# Altium project Dashcam_V2.0B.PrjPcb (part 6 of 7)

## Sheet Converter.SchDoc: CONVERTER
size A2; DrawnBy: UKAYACIK; Engineer: UKAYACIK; DocumentNumber: 14; Revision: B; SheetNumber: 11; SheetTotal: 21
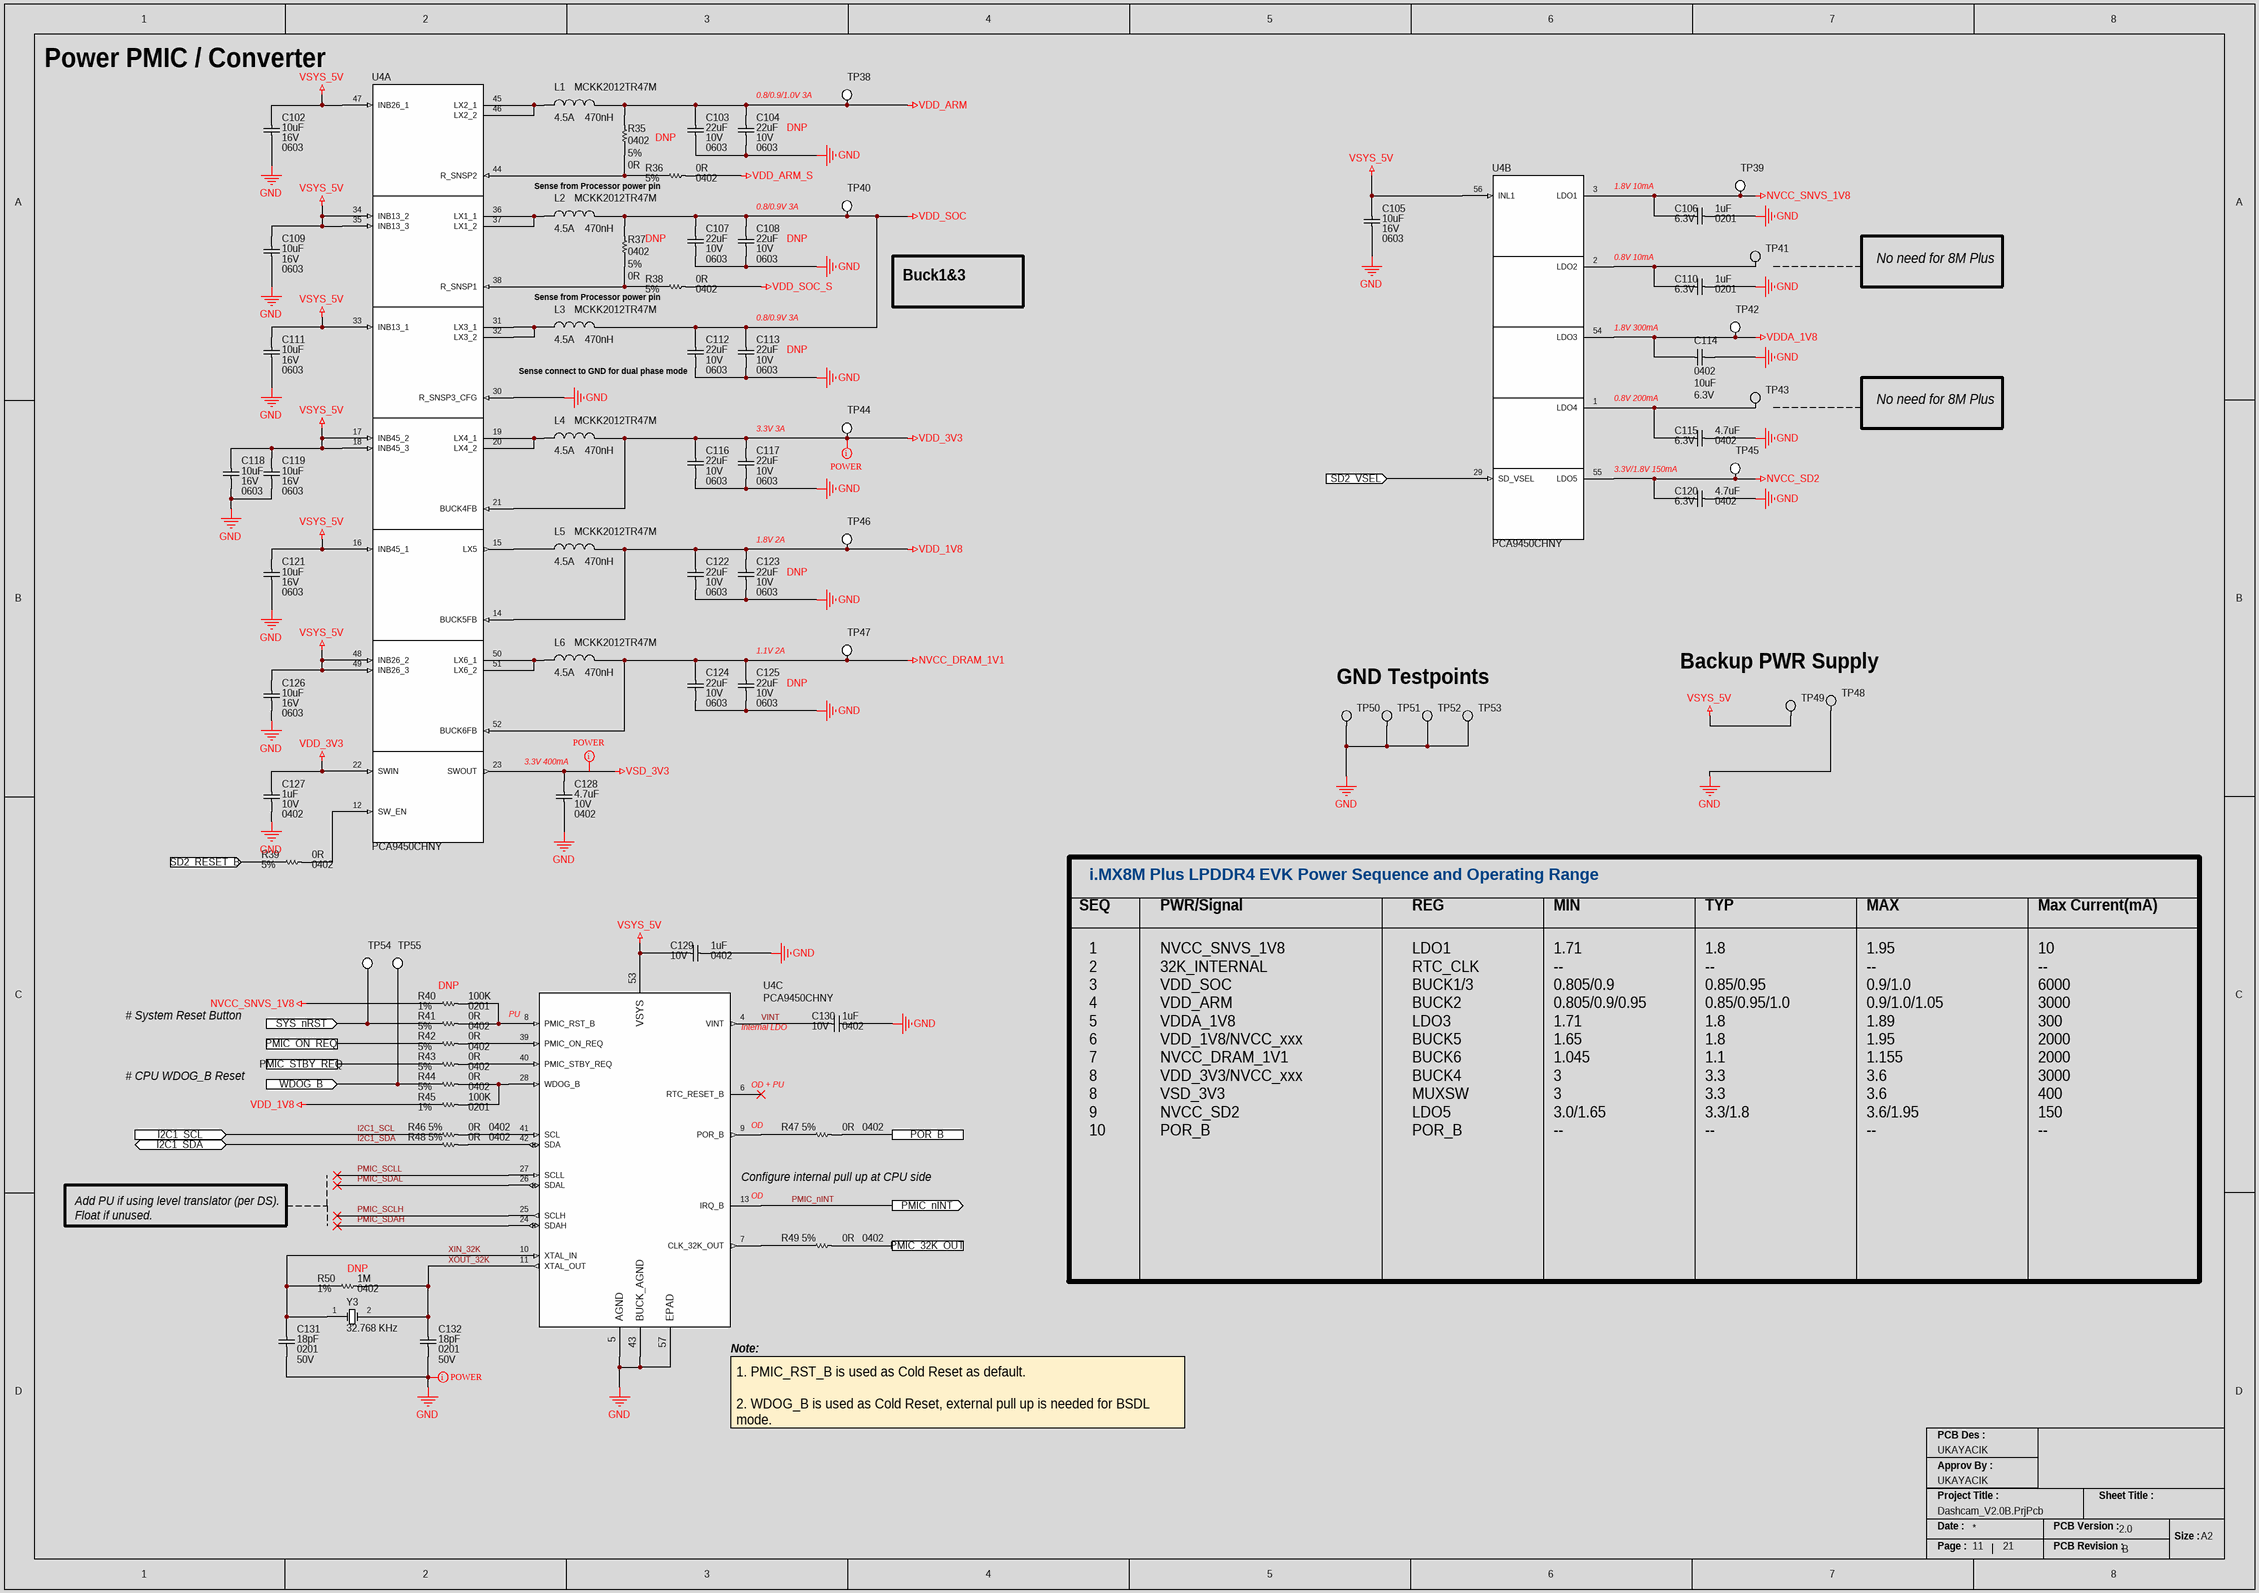
[diagram p13: Converter.SchDoc]

### Parts
C102  Voltage Rating: 16V  Capacitance: 10uF  Case/Package: 0603  [CAP_0603_CAPC1608X08N]  (hidden comment: GRM188R61C106MAALD)
C103  Capacitance: 22uF  Voltage Rating: 10V  Case Code (Imperial): 0603  [CAP_0603_CAPC1608X08N]  (hidden comment: C1608X5R1A226M080AC)
C104  Capacitance: 22uF  Voltage Rating: 10V  Case Code (Imperial): 0603  [CAP_0603_CAPC1608X08N]  (hidden comment: C1608X5R1A226M080AC)
C105  Voltage Rating: 16V  Capacitance: 10uF  Case/Package: 0603  [CAP_0603_CAPC1608X08N]  (hidden comment: GRM188R61C106MAALD)
C106  Voltage Rating (DC): 6.3V  Capacitance: 1uF  Case/Package: 0201  [CAP_0201_CAPC0603X03N]  (hidden comment: 02016D105MAT2A)
C107  Capacitance: 22uF  Voltage Rating: 10V  Case Code (Imperial): 0603  [CAP_0603_CAPC1608X08N]  (hidden comment: C1608X5R1A226M080AC)
C108  Capacitance: 22uF  Voltage Rating: 10V  Case Code (Imperial): 0603  [CAP_0603_CAPC1608X08N]  (hidden comment: C1608X5R1A226M080AC)
C109  Voltage Rating: 16V  Capacitance: 10uF  Case/Package: 0603  [CAP_0603_CAPC1608X08N]  (hidden comment: GRM188R61C106MAALD)
C110  Voltage Rating (DC): 6.3V  Capacitance: 1uF  Case/Package: 0201  [CAP_0201_CAPC0603X03N]  (hidden comment: 02016D105MAT2A)
C111  Voltage Rating: 16V  Capacitance: 10uF  Case/Package: 0603  [CAP_0603_CAPC1608X08N]  (hidden comment: GRM188R61C106MAALD)
C112  Capacitance: 22uF  Voltage Rating: 10V  Case Code (Imperial): 0603  [CAP_0603_CAPC1608X08N]  (hidden comment: C1608X5R1A226M080AC)
C113  Capacitance: 22uF  Voltage Rating: 10V  Case Code (Imperial): 0603  [CAP_0603_CAPC1608X08N]  (hidden comment: C1608X5R1A226M080AC)
C114  Case/Package: 0402  Capacitance: 10uF  Voltage Rating: 6.3V  [CAP_0402_CAPC1005X05N]  (hidden comment: CL05A106MQ5NUNC)
C115  Capacitance: 4.7uF  Voltage Rating: 6.3V  Case/Package: 0402  [CAP_0402_CAPC1005X05N]  (hidden comment: C1005X5R0J475M050BC)
C116  Capacitance: 22uF  Voltage Rating: 10V  Case Code (Imperial): 0603  [CAP_0603_CAPC1608X08N]  (hidden comment: C1608X5R1A226M080AC)
C117  Capacitance: 22uF  Voltage Rating: 10V  Case Code (Imperial): 0603  [CAP_0603_CAPC1608X08N]  (hidden comment: C1608X5R1A226M080AC)
C118  Voltage Rating: 16V  Capacitance: 10uF  Case/Package: 0603  [CAP_0603_CAPC1608X08N]  (hidden comment: GRM188R61C106MAALD)
C119  Voltage Rating: 16V  Capacitance: 10uF  Case/Package: 0603  [CAP_0603_CAPC1608X08N]  (hidden comment: GRM188R61C106MAALD)
C120  Capacitance: 4.7uF  Voltage Rating: 6.3V  Case/Package: 0402  [CAP_0402_CAPC1005X05N]  (hidden comment: C1005X5R0J475M050BC)
C121  Voltage Rating: 16V  Capacitance: 10uF  Case/Package: 0603  [CAP_0603_CAPC1608X08N]  (hidden comment: GRM188R61C106MAALD)
C122  Capacitance: 22uF  Voltage Rating: 10V  Case Code (Imperial): 0603  [CAP_0603_CAPC1608X08N]  (hidden comment: C1608X5R1A226M080AC)
C123  Capacitance: 22uF  Voltage Rating: 10V  Case Code (Imperial): 0603  [CAP_0603_CAPC1608X08N]  (hidden comment: C1608X5R1A226M080AC)
C124  Capacitance: 22uF  Voltage Rating: 10V  Case Code (Imperial): 0603  [CAP_0603_CAPC1608X08N]  (hidden comment: C1608X5R1A226M080AC)
C125  Capacitance: 22uF  Voltage Rating: 10V  Case Code (Imperial): 0603  [CAP_0603_CAPC1608X08N]  (hidden comment: C1608X5R1A226M080AC)
C126  Voltage Rating: 16V  Capacitance: 10uF  Case/Package: 0603  [CAP_0603_CAPC1608X08N]  (hidden comment: GRM188R61C106MAALD)
C127  Voltage Rating: 10V  Capacitance: 1uF  Case/Package: 0402  [CAP_0402_CAPC1005X05N]  (hidden comment: GRM155C81A105KA12D)
C128  Capacitance: 4.7uF  Voltage Rating: 10V  Case/Package: 0402  [CAP_0402_CAPC1005X05N]  (hidden comment: CL05A475KP5NRNC)
C129  Voltage Rating: 10V  Capacitance: 1uF  Case/Package: 0402  [CAP_0402_CAPC1005X05N]  (hidden comment: GRM155C81A105KA12D)
C130  Voltage Rating: 10V  Capacitance: 1uF  Case/Package: 0402  [CAP_0402_CAPC1005X05N]  (hidden comment: GRM155C81A105KA12D)
C131  Capacitance: 18pF  Voltage Rating: 50V  Case/Package: 0201  [CAP_0201_CAPC0603X03N]  (hidden comment: GRM0335C1H180JA01D)
C132  Capacitance: 18pF  Voltage Rating: 50V  Case/Package: 0201  [CAP_0201_CAPC0603X03N]  (hidden comment: GRM0335C1H180JA01D)
L1  MCKK2012TR47M  Current Rating: 4.5A  Inductance: 470nH  [IND_0805_INDC2012X10N]
L2  MCKK2012TR47M  Current Rating: 4.5A  Inductance: 470nH  [IND_0805_INDC2012X10N]
L3  MCKK2012TR47M  Current Rating: 4.5A  Inductance: 470nH  [IND_0805_INDC2012X10N]
L4  MCKK2012TR47M  Current Rating: 4.5A  Inductance: 470nH  [IND_0805_INDC2012X10N]
L5  MCKK2012TR47M  Current Rating: 4.5A  Inductance: 470nH  [IND_0805_INDC2012X10N]
L6  MCKK2012TR47M  Current Rating: 4.5A  Inductance: 470nH  [IND_0805_INDC2012X10N]
R35  Case Code (Imperial): 0402  Tolerance: 5%  Resistance: 0R  [RES_0402_RESC1005X04N]  (hidden comment: ERJ-2GE0R00X)
R36  Case Code (Imperial): 0402  Tolerance: 5%  Resistance: 0R  [RES_0402_RESC1005X04N]  (hidden comment: ERJ-2GE0R00X)
R37  Case Code (Imperial): 0402  Tolerance: 5%  Resistance: 0R  [RES_0402_RESC1005X04N]  (hidden comment: ERJ-2GE0R00X)
R38  Case Code (Imperial): 0402  Tolerance: 5%  Resistance: 0R  [RES_0402_RESC1005X04N]  (hidden comment: ERJ-2GE0R00X)
R39  Case Code (Imperial): 0402  Tolerance: 5%  Resistance: 0R  [RES_0402_RESC1005X04N]  (hidden comment: ERJ-2GE0R00X)
R40  Resistance: 100K  Tolerance: 1%  Case/Package: 0201  [RES_0201_RESC0603X02N]  (hidden comment: RC0201FR-07100KL)
R41  Case Code (Imperial): 0402  Tolerance: 5%  Resistance: 0R  [RES_0402_RESC1005X04N]  (hidden comment: ERJ-2GE0R00X)
R42  Case Code (Imperial): 0402  Tolerance: 5%  Resistance: 0R  [RES_0402_RESC1005X04N]  (hidden comment: ERJ-2GE0R00X)
R43  Case Code (Imperial): 0402  Tolerance: 5%  Resistance: 0R  [RES_0402_RESC1005X04N]  (hidden comment: ERJ-2GE0R00X)
R44  Case Code (Imperial): 0402  Tolerance: 5%  Resistance: 0R  [RES_0402_RESC1005X04N]  (hidden comment: ERJ-2GE0R00X)
R45  Resistance: 100K  Tolerance: 1%  Case/Package: 0201  [RES_0201_RESC0603X02N]  (hidden comment: RC0201FR-07100KL)
R46  Case Code (Imperial): 0402  Tolerance: 5%  Resistance: 0R  [RES_0402_RESC1005X04N]  (hidden comment: ERJ-2GE0R00X)
R47  Case Code (Imperial): 0402  Tolerance: 5%  Resistance: 0R  [RES_0402_RESC1005X04N]  (hidden comment: ERJ-2GE0R00X)
R48  Case Code (Imperial): 0402  Tolerance: 5%  Resistance: 0R  [RES_0402_RESC1005X04N]  (hidden comment: ERJ-2GE0R00X)
R49  Case Code (Imperial): 0402  Tolerance: 5%  Resistance: 0R  [RES_0402_RESC1005X04N]  (hidden comment: ERJ-2GE0R00X)
R50  Resistance: 1M  Tolerance: 1%  Case/Package: 0402  [RES_0402_RESC1005X04N]  (hidden comment: CR0402-FX-1004GLF)
TP38  NO COMPONENT  [TP_PAD_0.8MM_SMD_ROUND]  (value not drawn)  (no BOM)
TP39  NO COMPONENT  [TP_PAD_0.8MM_SMD_ROUND]  (value not drawn)  (no BOM)
TP40  NO COMPONENT  [TP_PAD_0.8MM_SMD_ROUND]  (value not drawn)  (no BOM)
TP41  NO COMPONENT  [TP_PAD_0.5MM_SMD_ROUND]  (value not drawn)  (no BOM)
TP42  NO COMPONENT  [TP_PAD_0.8MM_SMD_ROUND]  (value not drawn)  (no BOM)
TP43  NO COMPONENT  [TP_PAD_0.5MM_SMD_ROUND]  (value not drawn)  (no BOM)
TP44  NO COMPONENT  [TP_PAD_0.8MM_SMD_ROUND]  (value not drawn)  (no BOM)
TP45  NO COMPONENT  [TP_PAD_0.8MM_SMD_ROUND]  (value not drawn)  (no BOM)
TP46  NO COMPONENT  [TP_PAD_0.8MM_SMD_ROUND]  (value not drawn)  (no BOM)
TP47  NO COMPONENT  [TP_PAD_0.8MM_SMD_ROUND]  (value not drawn)  (no BOM)
TP48  NO COMPONENT  [TP_PAD_0.5MM_SMD_ROUND]  (value not drawn)  (no BOM)
TP49  NO COMPONENT  [TP_PAD_0.5MM_SMD_ROUND]  (value not drawn)  (no BOM)
TP50  NO COMPONENT  [TP_PAD_0.5MM_SMD_ROUND]  (value not drawn)  (no BOM)
TP51  NO COMPONENT  [TP_PAD_0.5MM_SMD_ROUND]  (value not drawn)  (no BOM)
TP52  NO COMPONENT  [TP_PAD_0.5MM_SMD_ROUND]  (value not drawn)  (no BOM)
TP53  NO COMPONENT  [TP_PAD_0.5MM_SMD_ROUND]  (value not drawn)  (no BOM)
TP54  NO COMPONENT  [TP_PAD_0.8MM_SMD_ROUND]  (value not drawn)  (no BOM)
TP55  NO COMPONENT  [TP_PAD_0.8MM_SMD_ROUND]  (value not drawn)  (no BOM)
U4  PCA9450CHNY  [IC_PMIC_QFN40P800X800X100-57N-D]  (parts A,B,C of 3)
Y3  Operating Frequency: 32.768 KHz  [CRYSTAL_ABS07-32.768KHZ-T]  (hidden comment: ABS07-32.768KHZ-T)

### Ports
I2C1_SCL (in), I2C1_SDA (bidir), PMIC_32K_OUT, PMIC_nINT (out), PMIC_ON_REQ, PMIC_STBY_REQ, POR_B, SD2_RESET_B (in), SD2_VSEL (in), SYS_nRST (in), WDOG_B (in)

### Nets
GND: C102.1 C103.1 C104.1 C105.1 C106.2 C107.1 C108.1 C109.1 C110.2 C111.1 C112.1 C113.1 C114.1 C115.2 C116.1 C117.1 C118.1 C119.1 C120.2 C121.1 C122.1 C123.1 C124.1 C125.1 C126.1 C127.1 C128.1 C129.1 C130.1 C131.1 C132.1 TP48.1 TP50.1 TP51.1 TP52.1 TP53.1 U4.5(AGND) U4.30(R_SNSP3_CFG) U4.43(BUCK_AGND) U4.57(EPAD)
NVCC_DRAM_1V1: C124.2 C125.2 L6.2 TP47.1 U4.52(BUCK6FB)
NVCC_SD2: C120.1 TP45.1 U4.55(LDO5)
NVCC_SNVS_1V8: C106.1 R40.1 TP39.1 U4.3(LDO1)
VDD_1V8: C122.2 C123.2 L5.2 R45.1 TP46.1 U4.14(BUCK5FB)
VDD_3V3: C116.2 C117.2 C127.2 L4.2 TP44.1 U4.21(BUCK4FB) U4.22(SWIN)
VDD_ARM: C103.2 C104.2 L1.2 R35.2 TP38.1
VDD_ARM_S: R36.2
VDD_SOC: C107.2 C108.2 C112.2 C113.2 L2.2 L3.2 R37.2 TP40.1
VDD_SOC_S: R38.2
VDDA_1V8: C114.2 TP42.1 U4.54(LDO3)
VSD_3V3: C128.2 U4.23(SWOUT)
VSYS_5V: C102.2 C105.2 C109.2 C111.2 C118.2 C119.2 C121.2 C126.2 C129.2 TP49.1 U4.16(INB45_1) U4.17(INB45_2) U4.18(INB45_3) U4.33(INB13_1) U4.34(INB13_2) U4.35(INB13_3) U4.47(INB26_1) U4.48(INB26_2) U4.49(INB26_3) U4.53(VSYS) U4.56(INL1)
I2C1_SCL: R46.1 ; port I2C1_SCL
I2C1_SDA: R48.1 ; port I2C1_SDA
PMIC_nINT: U4.13(IRQ_B) ; port PMIC_nINT
PMIC_ON_REQ: R42.1 ; port PMIC_ON_REQ
PMIC_SCLH: U4.25(SCLH)
PMIC_SCLL: U4.27(SCLL)
PMIC_SDAH: U4.24(SDAH)
PMIC_SDAL: U4.26(SDAL)
PMIC_STBY_REQ: R43.1 ; port PMIC_STBY_REQ
POR_B: R47.2 ; port POR_B
SD2_RESET_B: R39.1 ; port SD2_RESET_B
SD2_VSEL: U4.29(SD_VSEL) ; port SD2_VSEL
SLP_CLK_IN: R49.2 ; port PMIC_32K_OUT
SYS_nRST: R41.1 TP54.1 ; port SYS_nRST
VINT: C130.2 U4.4(VINT)
WDOG_B: R44.1 TP55.1 ; port WDOG_B
XIN_32K: C131.2 R50.1 U4.10(XTAL_IN) Y3.1(OSC1)
XOUT_32K: C132.2 R50.2 U4.11(XTAL_OUT) Y3.2(OSC2)
NetC110_1: C110.1 TP41.1 U4.2(LDO2)
NetC115_1: C115.1 TP43.1 U4.1(LDO4)
NetL1_1: L1.1 U4.45(LX2_1) U4.46(LX2_2)
NetL2_1: L2.1 U4.36(LX1_1) U4.37(LX1_2)
NetL3_1: L3.1 U4.31(LX3_1) U4.32(LX3_2)
NetL4_1: L4.1 U4.19(LX4_1) U4.20(LX4_2)
NetL5_1: L5.1 U4.15(LX5)
NetL6_1: L6.1 U4.50(LX6_1) U4.51(LX6_2)
NetR35_1: R35.1 R36.1 U4.44(R_SNSP2)
NetR37_1: R37.1 R38.1 U4.38(R_SNSP1)
NetR39_2: R39.2 U4.12(SW_EN)
NetR40_2: R40.2 R41.2 U4.8(PMIC_RST_B)
NetR42_2: R42.2 U4.39(PMIC_ON_REQ)
NetR43_2: R43.2 U4.40(PMIC_STBY_REQ)
NetR44_2: R44.2 R45.2 U4.28(WDOG_B)
NetR46_2: R46.2 U4.41(SCL)
NetR47_1: R47.1 U4.9(POR_B)
NetR48_2: R48.2 U4.42(SDA)
NetR49_1: R49.1 U4.7(CLK_32K_OUT)

Not connected (* = marked no-connect by the designer): U4 6(RTC_RESET_B)*

### Layout directives
net class POWER: GND, VDD_3V3, VSD_3V3

### Notes on the sheet
- Power PMIC / Converter
- DNP
- 0.8/0.9/1.0V 3A
- (near R36) Sense from Processor power pin
- 1.8V 10mA
- (near R37) DNP
- 0.8/0.9V 3A
- Buck1&3
  Dual Phase Mode
- 0.8V 10mA
- No need for 8M Plus
- (near R38) Sense from Processor power pin
- (near C113) 0.8/0.9V 3A
- 1.8V 300mA
- (near C112) Sense connect to GND for dual phase mode
- (near C117) 3.3V 3A
- (near U4) 0.8V 200mA
- 3.3V/1.8V 150mA
- (near C123) 1.8V 2A
- (near C125) 1.1V 2A
- GND Testpoints
- Backup PWR Supply
- (near C128) 3.3V 400mA
- i.MX8M Plus LPDDR4 EVK Power Sequence and Operating Range
- SEQ
- PWR/Signal
- REG
- MIN
- TYP
- MAX
- Max Current(mA)
- (near R40) DNP
- # System Reset Button
- (near U4) PU
- (near U4) Internal LDO
- # CPU WDOG_B Reset
- (near U4) OD + PU
- (near U4) OD
- (near U4) Configure internal pull up at CPU side
- 1
  2
  3
  4
  5
  6
  7
  8
  8
  9
  10
- NVCC_SNVS_1V8
  32K_INTERNAL
  VDD_SOC
  VDD_ARM
  VDDA_1V8
  VDD_1V8/NVCC_xxx
  NVCC_DRAM_1V1
  VDD_3V3/NVCC_xxx
  VSD_3V3
  NVCC_SD2
  POR_B
- LDO1
  RTC_CLK
  BUCK1/3
  BUCK2
  LDO3
  BUCK5
  BUCK6
  BUCK4
  MUXSW
  LDO5
  POR_B
- 1.71
  --
  0.805/0.9
  0.805/0.9/0.95
  1.71
  1.65
  1.045
  3
  3
  3.0/1.65
  --
- 1.8
  --
  0.85/0.95
  0.85/0.95/1.0
  1.8
  1.8
  1.1
  3.3
  3.3
  3.3/1.8
  --
- 1.95
  --
  0.9/1.0
  0.9/1.0/1.05
  1.89
  1.95
  1.155
  3.6
  3.6
  3.6/1.95
  --
- 10
  --
  6000
  3000
  300
  2000
  2000
  3000
  400
  150
  --
- Add PU if using level translator (per DS).
  Float if unused.
- (near R50) DNP
- (near U4) Note:
- (near U4) 1. PMIC_RST_B is used as Cold Reset as default.
  2. WDOG_B is used as Cold Reset, external pull up is needed for BSDL mode.
- PCB Des :
- Approv By :
- Project Title :
- Sheet Title :
- Date :
- Page :
- PCB Version :
- PCB Revision :
- Size :
- A2

### Library data of the parts
C102 C105 C109 C111 C118 C119 C121 C126 = CAP_10UF_16V_X5R_0603: 0603 10 uF 16 V ±20% Tolerance X5R Multilayer Ceramic Chip Capacitor; Manufacturer: Murata; Manufacturer Part Number: GRM188R61C106MAALD; RoHS: Yes; Category: Ceramic Capacitors; Stock 1: 566627; Pricing 1: 1=0.24000, 10=0.16500, 50=0.11000, 100=0.09340, 500=0.06596, 1000=0.05771 (USD); Mount: Surface Mount; Case Code (Metric): 1608; Material: Ceramic; Case Code (Imperial): 0603; Min Operating Temperature: -55°C; Max Operating Temperature: 85°C; Tolerance: 20%; Packaging: Cut Tape; Voltage Rating (DC): 16V; Length: 0.063inch; Width: 0.031inch; Height: 0.8mm; Thickness: 0.037inch; Lead Free: Lead Free; RoHS Compliant: Yes; ComponentLink1URL: http://search.murata.co.jp/Ceramy/image/img/A01X/G101/ENG/GRM188R61C106MAAL-01.pdf?src-supplier=Digi-Key; ComponentLink1Description: http://search.murata.co.jp/Ceramy/image/img/A01X/G101/ENG/GRM188R61C106MAAL-01.pdf?src-supplier=Digi-Key; ComponentLink2URL: https://search.murata.co.jp/Ceramy/image/img/A01X/G101/ENG/GRM188R61C106MAAL-01.pdf?src-supplier=Digi-Key; ComponentLink2Description: https://search.murata.co.jp/Ceramy/image/img/A01X/G101/ENG/GRM188R61C106MAAL-01.pdf?src-supplier=Digi-Key; ComponentLink3URL: http://search.murata.co.jp/Ceramy/image/img/A01X/partnumbering_e_01.pdf?src-supplier=Digi-Key; ComponentLink3Description: http://search.murata.co.jp/Ceramy/image/img/A01X/partnumbering_e_01.pdf?src-supplier=Digi-Key; Supplier 1: Digi-Key; Supplier 2: Verical; Supplier 3: Mouser; Supplier Part Number 1: 490-10729-1-ND; Supplier Part Number 2: GRM188R61C106MAALD; Supplier Part Number 3: 81-GRM188R61C106MALD
C103 C104 C107 C108 C112 C113 C116 C117 C122-C125 = CAP_22UF_10V_X5R_0603: Multilayer Ceramic Capacitor, 22 uF, 10 V, ± 20%, X5R, 0603 [1608 Metric]; Manufacturer: TDK; Supplier 1: Digi-Key; Manufacturer Part Number: C1608X5R1A226M080AC; RoHS: Yes; Category: Ceramic Capacitors; Stock 1: 1971709; Pricing 1: 1=0.32, 10=0.208, 50=0.1534, 100=0.1248, 500=0.09856, 1000=0.08323 (USD); Mount: Surface Mount; Case/Package: 0603; Case Code (Metric): 1608; Dielectric Material: Ceramic; Weight: 7.1E-05oz; Min Operating Temperature: -55°C; Max Operating Temperature: 85°C; Tolerance: 20%; Packaging: Tape and Reel; Voltage Rating (DC): 10V; Termination: SMD/SMT; Series: C; Package Quantity: 4000; Dielectric: X5R; Length: 1.6mm; Width: 0.8mm; Height: 0.8mm; Reach SVHC Compliant: No; Lead Free: Lead Free; RoHS Compliant: Yes; ComponentLink1URL: https://datasheet.ciiva.com/6274/tdkmlcccaprange-6274860.pdf?src-supplier=Digi-Key; ComponentLink1Description: https://datasheet.ciiva.com/6274/tdkmlcccaprange-6274860.pdf?src-supplier=Digi-Key; ComponentLink2URL: https://datasheet.ciiva.com/6274/tdkmlcccaprange-6274859.pdf?src-supplier=Digi-Key; ComponentLink2Description: https://datasheet.ciiva.com/6274/tdkmlcccaprange-6274859.pdf?src-supplier=Digi-Key; ComponentLink3URL: https://datasheet.ciiva.com/6274/tdkmlcccaprange-6274861.pdf?src-supplier=Digi-Key; ComponentLink3Description: https://datasheet.ciiva.com/6274/tdkmlcccaprange-6274861.pdf?src-supplier=Digi-Key; ComponentLink4URL: https://datasheet.ciiva.com/24216/mlcc-commercial-general-en-24216575.pdf?src-supplier=Mouser; ComponentLink4Description: https://datasheet.ciiva.com/24216/mlcc-commercial-general-en-24216575.pdf?src-supplier=Mouser; Supplier Part Number 1: 445-9077-1-ND
C106 C110 = CAP_1UF_6.3V_X5R_0201: 0201 1 uF 6.3 V ±20 % Tolerance X5R Surface Mount Multilayer Ceramic Capacitor; Manufacturer: Kyocera AVX; Tolerance: 20%; Supplier 1: Mouser; Manufacturer Part Number: 02016D105MAT2A; RoHS: Yes; Category: Ceramic Capacitors; Stock 1: 1026413; Pricing 1: 1=0.1, 10=0.028, 50=0.028, 100=0.014, 1000=0.008, 10000=0.006 (USD); Mount: Surface Mount; Number of Pins: 2; Case Code (Metric): 0603; Case Code (Imperial): 0201; Min Operating Temperature: -55°C; Max Operating Temperature: 85°C; Packaging: Cut Tape; Series: -; Voltage Rating: 6.3V; Package Quantity: 1; Length: 0.024inch; Width: 0.012inch; Thickness: 0.013inch; Depth: 0.3mm; Lead Free: Lead Free; RoHS Compliant: Yes; Reach SVHC Compliant: No; ComponentLink1URL: https://datasheet.ciiva.com/6265/cx5r-6265595.pdf?src-supplier=Digi-Key; ComponentLink1Description: https://datasheet.ciiva.com/6265/cx5r-6265595.pdf?src-supplier=Digi-Key; ComponentLink2URL: https://datasheet.ciiva.com/1123/1666675-1123122.pdf?src-supplier=Element14; ComponentLink2Description: https://datasheet.ciiva.com/1123/1666675-1123122.pdf?src-supplier=Element14; ComponentLink3URL: https://datasheet.ciiva.com/14891/cx5r-14891029.pdf?src-supplier=Digi-Key; ComponentLink3Description: https://datasheet.ciiva.com/14891/cx5r-14891029.pdf?src-supplier=Digi-Key; ComponentLink4URL: https://datasheet.ciiva.com/7614/cx5r-7614682.pdf?src-supplier=Digi-Key; ComponentLink4Description: https://datasheet.ciiva.com/7614/cx5r-7614682.pdf?src-supplier=Digi-Key; ComponentLink5URL: https://datasheet.ciiva.com/14891/cx5r-14891030.pdf?src-supplier=Digi-Key; ComponentLink5Description: https://datasheet.ciiva.com/14891/cx5r-14891030.pdf?src-supplier=Digi-Key; Supplier Part Number 1: 581-02016D105MAT2A; Dielectric: X5R
C114 = CAP_10UF_6.3V_X5R_0402: Cap Ceramic 10uF 6.3V X5R 20% SMD 0402 85C T/R; Manufacturer: Samsung; Supplier 1: Digikey; Manufacturer Part Number: CL05A106MQ5NUNC; RoHS: Yes; Category: Ceramic Capacitors; Stock 1: 6097180; Pricing 1: 1=0.24, 10=0.153, 50=0.0968, 100=0.0774, 500=0.05588, 1000=0.04943, 2500=0.04728, 5000=0.04299 (USD); Mount: Surface Mount; Case Code (Metric): 1005; Case Code (Imperial): 0402; Min Operating Temperature: -55°C; Max Operating Temperature: 85°C; Packaging: Tape and Reel; Tolerance: 20%; Dielectric: X5R; Series: CL; Package Quantity: 1; Construction: Flat; Length: 1mm; Width: 0.02inch; Height: 0.5mm; Depth: 0.5mm; Thickness: 0.028inch; Radiation Hardening: No; RoHS Compliant: Yes; ComponentLink1URL: https://datasheet.ciiva.com/16437/cl05a106mq5nunc-16437356.pdf?src-supplier=Future+Electronics; ComponentLink1Description: https://datasheet.ciiva.com/16437/cl05a106mq5nunc-16437356.pdf?src-supplier=Future+Electronics; ComponentLink2URL: https://datasheet.ciiva.com/26877/getdatasheetpartid-355289-26877841.pdf?src-supplier=Verical; ComponentLink2Description: https://datasheet.ciiva.com/26877/getdatasheetpartid-355289-26877841.pdf?src-supplier=Verical; Supplier Part Number 1: 1276-1451-1-ND
C115 C120 = CAP_4.7UF_6.3V_X5R_0402: Multilayer Ceramic Capacitor, 4.7 uF, 6.3 V, ± 20%, X5R, 0402 [1005 Metric]; Manufacturer: TDK; Material: 4241ConductorMaterial; Dissipation Factor: 10%; Supplier 1: Digi-Key; Manufacturer Part Number: C1005X5R0J475M050BC; RoHS: Yes; Category: Ceramic Capacitors; Stock 1: 799722; Pricing 1: 1=0.35, 10=0.233, 50=0.1716, 100=0.1396, 500=0.11024, 1000=0.0931, 2500=0.0882, 5000=0.0833 (USD); Mount: Surface Mount; Dielectric Material: Ceramic; Case Code (Metric): 1005; Case Code (Imperial): 0402; Weight: 2.3E-05oz; Min Operating Temperature: -55°C; Max Operating Temperature: 85°C; Packaging: Tape and Reel; Tolerance: 20%; Voltage Rating (DC): 6.3V; Dielectric: X5R; Package Quantity: 1; Termination: SMD/SMT; Voltage: 6.3V; Series: C; Construction: Flat; Length: 1mm; Width: 0.02inch; Height: 0.5mm; Depth: 0.5mm; Thickness: 0.026inch; Lead Free: Lead Free; Reach SVHC Compliant: No; RoHS Compliant: Yes; ComponentLink1URL: https://datasheet.ciiva.com/24216/c1005x5r0j475m050bc-264348-24216583.pdf?src-supplier=Mouser; ComponentLink1Description: https://datasheet.ciiva.com/24216/c1005x5r0j475m050bc-264348-24216583.pdf?src-supplier=Mouser; ComponentLink2URL: https://datasheet.ciiva.com/5962/639999-5962567.pdf?src-supplier=Farnell; ComponentLink2Description: https://datasheet.ciiva.com/5962/639999-5962567.pdf?src-supplier=Farnell; ComponentLink3URL: https://datasheet.ciiva.com/22648/1796654-22648701.pdf?src-supplier=Element14; ComponentLink3Description: https://datasheet.ciiva.com/22648/1796654-22648701.pdf?src-supplier=Element14; ComponentLink4URL: https://datasheet.ciiva.com/22749/1744655-22749711.pdf?src-supplier=Element14; ComponentLink4Description: https://datasheet.ciiva.com/22749/1744655-22749711.pdf?src-supplier=Element14; ComponentLink5URL: https://datasheet.ciiva.com/7770/639999-7770124.pdf?src-supplier=Element14; ComponentLink5Description: https://datasheet.ciiva.com/7770/639999-7770124.pdf?src-supplier=Element14; ComponentLink6URL: https://datasheet.ciiva.com/6289/tdkmlcccaprange-6289886.pdf?src-supplier=Digi-Key; ComponentLink6Description: https://datasheet.ciiva.com/6289/tdkmlcccaprange-6289886.pdf?src-supplier=Digi-Key; ComponentLink7URL: https://datasheet.ciiva.com/6289/tdkmlcccaprange-6289895.pdf?src-supplier=Digi-Key; ComponentLink7Description: https://datasheet.ciiva.com/6289/tdkmlcccaprange-6289895.pdf?src-supplier=Digi-Key; ComponentLink8URL: https://datasheet.ciiva.com/16425/e412-c-16425670.pdf?src-supplier=Future+Electronics; ComponentLink8Description: https://datasheet.ciiva.com/16425/e412-c-16425670.pdf?src-supplier=Future+Electronics; Supplier Part Number 1: 445-7395-1-ND
C127 C129 C130 = CAP_1UF_10V_X6S_0402: 0402 10 V 1 uF ±10% Tolerance X6S Multilayer Ceramic Capacitor; Manufacturer: Murata; Supplier 1: Digikey; Manufacturer Part Number: GRM155C81A105KA12D; RoHS: Yes; Category: Ceramic Capacitors; Stock 1: 2486564; Pricing 1: 1=0.1, 10=0.045, 50=0.026, 100=0.0202, 500=0.01518, 1000=0.01192, 2500=0.01084, 5000=0.00997 (USD); Mount: Surface Mount; Case Code (Metric): 1005; Material: Ceramic; Case Code (Imperial): 0402; Weight: 0.000212oz; Min Operating Temperature: -55°C; Max Operating Temperature: 105°C; Dielectric: X6S; Packaging: Tape and Reel; Termination: SMD/SMT; Voltage Rating (DC): 10V; Package Quantity: 10000; Series: GRM; Length: 1mm; Width: 0.5mm; Height: 0.5mm; Thickness: 0.022inch; Lead Free: Lead Free; RoHS Compliant: Yes; ComponentLink1URL: http://www.mouser.com/ds/2/281/c02e-2905.pdf?src-supplier=Mouser; ComponentLink1Description: http://www.mouser.com/ds/2/281/c02e-2905.pdf?src-supplier=Mouser; ComponentLink2URL: https://datasheet.octopart.com/GRM155C81A105KA12D-Murata-datasheet-22122223.pdf?src-supplier=Future+Electronics; ComponentLink2Description: https://datasheet.octopart.com/GRM155C81A105KA12D-Murata-datasheet-22122223.pdf?src-supplier=Future+Electronics; ComponentLink3URL: https://datasheet.octopart.com/GRM155C81A105KA12D-Murata-datasheet-149522926.pdf?src-supplier=Newark; ComponentLink3Description: https://datasheet.octopart.com/GRM155C81A105KA12D-Murata-datasheet-149522926.pdf?src-supplier=Newark; ComponentLink4URL: http://search.murata.co.jp/Ceramy/image/img/A01X/G101/ENG/GRM155C81A105KA12-01.pdf?src-supplier=Digikey; ComponentLink4Description: http://search.murata.co.jp/Ceramy/image/img/A01X/G101/ENG/GRM155C81A105KA12-01.pdf?src-supplier=Digikey; ComponentLink5URL: http://search.murata.co.jp/Ceramy/image/img/A01X/partnumbering_e_01.pdf?src-supplier=Digikey; ComponentLink5Description: http://search.murata.co.jp/Ceramy/image/img/A01X/partnumbering_e_01.pdf?src-supplier=Digikey; ComponentLink6URL: https://datasheet.octopart.com/GRM155C81A105KA12D-Murata-datasheet-165579666.pdf?src-supplier=TME; ComponentLink6Description: https://datasheet.octopart.com/GRM155C81A105KA12D-Murata-datasheet-165579666.pdf?src-supplier=TME; Supplier Part Number 1: 490-12699-6-ND; Tolerance: 10%
C128 = CAP_4.7UF_10V_X5R_0402: Multilayer Ceramic Capacitor, 4.7 uF, 10 V, ± 10%, X5R, 0402 [1005 Metric]; Manufacturer: Samsung; Supplier 1: Digikey; Manufacturer Part Number: CL05A475KP5NRNC; RoHS: Yes; Category: Ceramic Capacitors; Stock 1: 748042; Pricing 1: 1=0.28, 10=0.184, 50=0.129, 100=0.1042, 500=0.0774, 1000=0.06772, 2500=0.0645, 5000=0.05966 (USD); Mount: Surface Mount; Case Code (Metric): 1005; Case Code (Imperial): 0402; Material: Ceramic; Min Operating Temperature: -55°C; Max Operating Temperature: 85°C; Tolerance: 10%; Packaging: Tape and Reel; Package Quantity: 1; Dielectric: X5R; Series: CL; Construction: Flat; Length: 1mm; Width: 0.02inch; Height: 0.5mm; Thickness: 0.022inch; Depth: 0.5mm; Radiation Hardening: No; RoHS Compliant: Yes; Lead Free: Lead Free; ComponentLink1URL: https://datasheet.ciiva.com/25724/cl05a475kp5nrnc-25724404.pdf?src-supplier=Digikey; ComponentLink1Description: https://datasheet.ciiva.com/25724/cl05a475kp5nrnc-25724404.pdf?src-supplier=Digikey; ComponentLink2URL: https://datasheet.ciiva.com/29198/458873-da-01-en-vs-kondensator-0402-29198304.pdf?src-supplier=Conrad; ComponentLink2Description: https://datasheet.ciiva.com/29198/458873-da-01-en-vs-kondensator-0402-29198304.pdf?src-supplier=Conrad; Supplier Part Number 1: 1276-1480-1-ND
C131 C132 = CAP_18PF_50V_NP0_0201: Multilayer Ceramic Capacitor, 18 pF, 50 V, ± 5%, C0G (NP0), 0201 [0603 Metric]; Manufacturer: Murata; Temperature Coefficient: 30ppm/°C; Supplier 1: Digikey; Manufacturer Part Number: GRM0335C1H180JA01D; RoHS: Yes; Category: Ceramic Capacitors; Stock 1: 464126; Pricing 1: 1=0.1, 10=0.011, 50=0.0062, 100=0.0048, 500=0.0036, 1000=0.00283, 2500=0.00258, 5000=0.00237 (USD); Mount: Surface Mount; Case Code (Metric): 0603; Case Code (Imperial): 0201; Material: Ceramic; Min Operating Temperature: -55°C; Max Operating Temperature: 125°C; Package Quantity: 15000; Packaging: Tape and Reel; Voltage Rating (DC): 50V; Termination: SMD/SMT; Series: GRM; Dielectric: C0G; Tolerance: 5%; Voltage: 50V; Length: 0.6mm; Width: 0.3mm; Height: 0.3mm; Depth: 0.3mm; Radiation Hardening: No; RoHS Compliant: Yes; Lead Free: Lead Free; Supplier Part Number 1: 490-6117-1-ND
L1-L6 = IND_0.47uH_4.5A_MCKK2012TR47M: Inductor Power Chip Multi-Layer 0.47uH 20% 1MHz Metal 3.1A 0.039Ohm DCR 0805 T/R; Manufacturer: Taiyo Yuden; Shielding: Shielded; DC Resistance (DCR): 39mR; Supplier 1: Digi-Key; Manufacturer Part Number: MCKK2012TR47M; RoHS: Yes; Category: Fixed Inductors; Stock 1: 59761; Pricing 1: 1=0.34, 10=0.279, 25=0.2572, 50=0.2358, 100=0.2079, 250=0.20152, 500=0.18008, 1000=0.14577 (USD); Mount: Surface Mount; Case/Package: 0805; Core Material: Metal; Case Code (Metric): 2012; Min Operating Temperature: -40°C; Max Operating Temperature: 125°C; Packaging: Cut Tape; Tolerance: 20%; Test Frequency: 1MHz; Series: MCOIL™, MC; RoHS Compliant: Yes; ComponentLink1URL: https://ds.yuden.co.jp/TYCOMPAS/ut/detail?pn=MCKK2012TR47M &amp;u=M&src-supplier=Digi-Key; ComponentLink1Description: https://ds.yuden.co.jp/TYCOMPAS/ut/detail?pn=MCKK2012TR47M &amp;u=M&src-supplier=Digi-Key; ComponentLink2URL: http://ds.yuden.co.jp/TYCOMPAS/ut/detail.do?productNo=MCKK2012TR47M&fileName=MCKK2012TR47M_SS&mode=specSheetDownload&src-supplier=Digi-Key; ComponentLink2Description: http://ds.yuden.co.jp/TYCOMPAS/ut/detail.do?productNo=MCKK2012TR47M&fileName=MCKK2012TR47M_SS&mode=specSheetDownload&src-supplier=Digi-Key; ComponentLink3URL: http://ds.yuden.co.jp/TYCOMPAS/ut/detail.do?productNo=MCKK2012TR47M&amp;fileName=MCKK2012TR47M_SS&amp;mode=specSheetDownload&src-supplier=Digi-Key; ComponentLink3Description: http://ds.yuden.co.jp/TYCOMPAS/ut/detail.do?productNo=MCKK2012TR47M&amp;fileName=MCKK2012TR47M_SS&amp;mode=specSheetDownload&src-supplier=Digi-Key; Supplier Part Number 1: 587-5632-1-ND; Case Code (Imperial): 0805
R35-R39 R41-R44 R46-R49 = RES_0R_5%_100mW_0402: SMD Chip Resistor, Jumper, 0 ohm, 100 mW, 0402 [1005 Metric], Thick Film, General Purpose; Manufacturer: Panasonic; Power Rating: 100mW; Voltage Rating: 50V; Temperature Coefficient: 600ppm/°C; Supplier 1: Mouser; Manufacturer Part Number: ERJ-2GE0R00X; RoHS: Yes; Category: Chip SMD Resistors; Stock 1: 10989354; Pricing 1: 1=0.1, 10=0.013, 50=0.013, 100=0.006, 1000=0.004, 2500=0.003, 10000=0.003 (USD); Mount: Surface Mount; Case/Package: 0402; Contact Plating: Tin; Case Code (Metric): 1005; Size Code: 0402; Min Operating Temperature: -55°C; Max Operating Temperature: 155°C; Resistor Type: Thick Film; Packaging: Cut Tape; Package Quantity: 10000; Number of Terminations: 2; Termination: SMD/SMT; Max Power Dissipation: 100mW; Voltage Rating (DC): 50V; Features: Automotive AEC-Q200; Series: ERJ; Construction: Rectangular; Technology: THICK FILM; Length: 1mm; Width: 0.5mm; Height: 0.35mm; Depth: 0.5mm; Ratings: AEC-Q200; Radiation Hardening: No; Reach SVHC Compliant: No; Military Standard: Not; Lead Free: Lead Free; RoHS Compliant: Yes; ComponentLink1URL: https://datasheet.ciiva.com/11821/0900766b80f806dd-11821176.pdf?src-supplier=Rs; ComponentLink1Description: https://datasheet.ciiva.com/11821/0900766b80f806dd-11821176.pdf?src-supplier=Rs; ComponentLink2URL: https://datasheet.ciiva.com/43460/1678796-43460347.pdf?src-supplier=Farnell; ComponentLink2Description: https://datasheet.ciiva.com/43460/1678796-43460347.pdf?src-supplier=Farnell; ComponentLink3URL: https://datasheet.ciiva.com/46389/1678796-46389518.pdf?src-supplier=Element14; ComponentLink3Description: https://datasheet.ciiva.com/46389/1678796-46389518.pdf?src-supplier=Element14; ComponentLink4URL: https://datasheet.ciiva.com/5959/1678796-5959692.pdf?src-supplier=Farnell; ComponentLink4Description: https://datasheet.ciiva.com/5959/1678796-5959692.pdf?src-supplier=Farnell; ComponentLink5URL: https://datasheet.ciiva.com/28695/1678796-28695758.pdf?src-supplier=Element14; ComponentLink5Description: https://datasheet.ciiva.com/28695/1678796-28695758.pdf?src-supplier=Element14; ComponentLink6URL: https://datasheet.ciiva.com/16783/70260739-16783734.pdf?src-supplier=Allied+Electronics; ComponentLink6Description: https://datasheet.ciiva.com/16783/70260739-16783734.pdf?src-supplier=Allied+Electronics; ComponentLink7URL: https://datasheet.ciiva.com/16778/70260739-16778335.pdf?src-supplier=Allied+Electronics; ComponentLink7Description: https://datasheet.ciiva.com/16778/70260739-16778335.pdf?src-supplier=Allied+Electronics; ComponentLink8URL: https://datasheet.ciiva.com/48531/aoa0000ce1-48531077.pdf?src-supplier=Avnet; ComponentLink8Description: https://datasheet.ciiva.com/48531/aoa0000ce1-48531077.pdf?src-supplier=Avnet; ComponentLink9URL: https://datasheet.ciiva.com/30097/4aoa0000ce1-30097116.pdf?src-supplier=Onlinecomponents.com; ComponentLink9Description: https://datasheet.ciiva.com/30097/4aoa0000ce1-30097116.pdf?src-supplier=Onlinecomponents.com; Supplier Part Number 1: 667-ERJ-2GE0R00X
R40 R45 = RES_100K_1%_50mW_0201: SMD Chip Resistor, 100 kOhm, ± 1%, 50 mW, 0201 [0603 Metric], Thick Film, General Purpose; Manufacturer: Yageo; Temperature Coefficient: 200ppm/°C; Power Rating: 50mW; Voltage Rating: 25V; Supplier 1: Digikey; Manufacturer Part Number: RC0201FR-07100KL; RoHS: Yes; Category: Chip SMD Resistors; Stock 1: 2564699; Pricing 1: 1=0.1, 10=0.027, 50=0.0172, 100=0.0143, 500=0.00988, 1000=0.00854, 5000=0.00629 (USD); Number of Pins: 2NUMBER; Contact Plating: Tin,Matte; Case Code (Imperial): 0201; Case Code (Metric): 0603; Size Code: 0201; Min Operating Temperature: -55°C; Max Operating Temperature: 125°C; Resistor Type: Thick Film; Packaging: Tape and Reel; Package Quantity: 10000; Termination: SMD/SMT; Number of Terminations: 2; Max Power Dissipation: 50mW; Features: Moisture Resistant; Series: RC; Resistance Tolerance: 1%; Construction: Rectangular; Voltage Rating (DC): 25V; Length: 0.024inch; Width: 0.012inch; Height: 0.01inch; Depth: 0.3mm; Reach SVHC Compliant: No; Military Standard: Not; RoHS Compliant: Yes; Lead Free: 5697LeadFree; ComponentLink1URL: https://datasheet.ciiva.com/2493/pyu-r-int-thick-7-2493769.pdf?src-supplier=Digikey; ComponentLink1Description: https://datasheet.ciiva.com/2493/pyu-r-int-thick-7-2493769.pdf?src-supplier=Digikey; ComponentLink2URL: https://datasheet.ciiva.com/2493/pyu-r-int-thick-7-2493770.pdf?src-supplier=Digikey; ComponentLink2Description: https://datasheet.ciiva.com/2493/pyu-r-int-thick-7-2493770.pdf?src-supplier=Digikey; ComponentLink3URL: https://datasheet.ciiva.com/2493/pyu-r-int-thick-7-2493771.pdf?src-supplier=Digikey; ComponentLink3Description: https://datasheet.ciiva.com/2493/pyu-r-int-thick-7-2493771.pdf?src-supplier=Digikey; ComponentLink4URL: https://datasheet.ciiva.com/26829/getdatasheetpartid-420441-26829850.pdf?src-supplier=Verical; ComponentLink4Description: https://datasheet.ciiva.com/26829/getdatasheetpartid-420441-26829850.pdf?src-supplier=Verical; ComponentLink5URL: https://datasheet.ciiva.com/22698/1563626-22698495.pdf?src-supplier=Element14; ComponentLink5Description: https://datasheet.ciiva.com/22698/1563626-22698495.pdf?src-supplier=Element14; ComponentLink6URL: https://datasheet.ciiva.com/7660/1421516-7660806.pdf?src-supplier=Element14; ComponentLink6Description: https://datasheet.ciiva.com/7660/1421516-7660806.pdf?src-supplier=Element14; ComponentLink7URL: https://datasheet.ciiva.com/46391/1421516-46391338.pdf?src-supplier=Element14; ComponentLink7Description: https://datasheet.ciiva.com/46391/1421516-46391338.pdf?src-supplier=Element14; Supplier Part Number 1: 311-100KMDKR-ND
R50 = RES_1M_1%_63mW_0402: Res Thick Film 0402 1M Ohm 1% 1/16W ±100ppm/°C Molded SMD SMD Paper Tape on Plastic Reel; Manufacturer: Bourns; Power Rating: 62.5mW; Voltage Rating: 50V; Max Power Dissipation: 63mW; Supplier 1: Digi-Key; Manufacturer Part Number: CR0402-FX-1004GLF; RoHS: Yes; Category: Chip SMD Resistors; Stock 1: 506989; Pricing 1: 1=0.1, 10=0.012, 50=0.0064, 100=0.0052, 500=0.00332, 1000=0.0028, 5000=0.00193 (USD); Mount: Surface Mount; Case Code (Metric): 1005; Case Code (Imperial): 0402; Contact Plating: Tin; Min Operating Temperature: -55°C; Max Operating Temperature: 125°C; Package Quantity: 10000; Packaging: Tape and Reel; Number of Terminations: 2; Termination: SMD/SMT; Temperature Coefficient: 100ppm/°C; Series: CR0402; Voltage Rating (DC): 50V; Length: 1mm; Width: 0.5mm; Height: 0.35mm; Thickness: 356um; Radiation Hardening: No; RoHS Compliant: Yes; ComponentLink1URL: http://www.mouser.com/ds/2/54/CR0402-72074.pdf?src-supplier=Mouser; ComponentLink1Description: http://www.mouser.com/ds/2/54/CR0402-72074.pdf?src-supplier=Mouser; ComponentLink2URL: http://www.farnell.com/datasheets/2194437.pdf?src-supplier=Farnell; ComponentLink2Description: http://www.farnell.com/datasheets/2194437.pdf?src-supplier=Farnell; ComponentLink3URL: http://components.arrow.com/part/dataview/41873878S8356545N1506?src-supplier=Arrow+Electronics; ComponentLink3Description: http://components.arrow.com/part/dataview/41873878S8356545N1506?src-supplier=Arrow+Electronics; ComponentLink4URL: https://datasheet.octopart.com/CR0402-FX-1004GLF-Bourns-datasheet-68301632.pdf?src-supplier=Farnell; ComponentLink4Description: https://datasheet.octopart.com/CR0402-FX-1004GLF-Bourns-datasheet-68301632.pdf?src-supplier=Farnell; ComponentLink5URL: http://www.bourns.com/pdfs/CR0402.pdf?src-supplier=Avnet; ComponentLink5Description: http://www.bourns.com/pdfs/CR0402.pdf?src-supplier=Avnet; ComponentLink6URL: https://www.bourns.com/docs/Product-Datasheets/CR0402.pdf?src-supplier=Digi-Key; ComponentLink6Description: https://www.bourns.com/docs/Product-Datasheets/CR0402.pdf?src-supplier=Digi-Key; ComponentLink7URL: http://www.farnell.com/datasheets/2194437.pdf?src-supplier=Element14; ComponentLink7Description: http://www.farnell.com/datasheets/2194437.pdf?src-supplier=Element14; ComponentLink8URL: http://www.farnell.com/datasheets/2194437.pdf?src-supplier=Newark; ComponentLink8Description: http://www.farnell.com/datasheets/2194437.pdf?src-supplier=Newark; ComponentLink9URL: https://datasheet.octopart.com/CR0402-FX-1004GLF-Bourns-datasheet-159578630.pdf?src-supplier=Electro+Sonic; ComponentLink9Description: https://datasheet.octopart.com/CR0402-FX-1004GLF-Bourns-datasheet-159578630.pdf?src-supplier=Electro+Sonic; ComponentLink10URL: https://datasheet.octopart.com/CR0402-FX-1004GLF-Bourns-datasheet-140567134.pdf?src-supplier=Arrow.cn; ComponentLink10Description: https://datasheet.octopart.com/CR0402-FX-1004GLF-Bourns-datasheet-140567134.pdf?src-supplier=Arrow.cn; Supplier Part Number 1: CR0402-FX-1004GLFCT-ND
TP38-TP40 TP42 TP44-TP47 TP54 TP55 = TP_PAD_SMD_Round: Test Point, SMD pad, round, 1.5mm, 1.6mm, 3mm diameter
TP41 TP43 TP48-TP53 = TP_PAD_SMD_SMALL: Test Point, SMD pad, round, 1.5mm, 1.6mm, 3mm diameter
U4 = IC_PMIC_8MPLUS_PCA9450CHNY: SAMPLE FPN ONLY - Power Management Specialized - PMIC PMIC for i.MX8M Plus(865S); Manufacturer: NXP Semiconductors; Supplier 1: Digikey; Manufacturer Part Number: PCA9450CHNY; RoHS: Yes; Category: Power Management ICs; Stock 1: 22066; Pricing 1: 1=6.6, 10=5.931, 25=5.6072, 100=4.8595, 250=4.61032, 500=4.13684, 1000=3.4889 (USD); RoHS Compliant: Yes; Supplier Part Number 1: 568-PCA9450CHNYCT-ND
Y3 = CRYSTAL_ABRACON_32.768KHz_ABS07-32.768KHZ-T: Crystal 0.032768MHz ±20ppm (Tol) 12.5pF Flexural 70000Ohm 2-Pin CSMD T/R; ESR (Equivalent Series Resistance): 70kR; Supplier 1: Digikey; Manufacturer: Abracon; Manufacturer Part Number: ABS07-32.768KHZ-T; RoHS: Yes; Category: Crystals; Stock 1: 1583168; Pricing 1: 1=0.69, 10=0.576, 50=0.5184, 100=0.4607, 500=0.43768, 1000=0.36858 (USD); Case/Package: CSMD; Number of Pins: 2; Min Operating Temperature: -40°C; Max Operating Temperature: 85°C; Frequency Tolerance: 20ppm; Load Capacitance: 12.5pF; Frequency: 32.768kHz; Packaging: Tape and Reel; Series: ABS07; Package Quantity: 3000; Tolerance: 20ppm; Termination: SMD/SMT; Series Resistance: 70kR; Length: 3.2mm; Width: 1.5mm; Height: 0.9mm; Depth: 1.5mm; Radiation Hardening: No; RoHS Compliant: Yes; Lead Free: Lead Free; Reach SVHC Compliant: No; ComponentLink1URL: https://datasheet.ciiva.com/7998/1912628-7998667.pdf?src-supplier=Element14; ComponentLink1Description: https://datasheet.ciiva.com/7998/1912628-7998667.pdf?src-supplier=Element14; ComponentLink2URL: https://datasheet.ciiva.com/1357/1883680-1357319.pdf?src-supplier=Element14; ComponentLink2Description: https://datasheet.ciiva.com/1357/1883680-1357319.pdf?src-supplier=Element14; ComponentLink3URL: https://datasheet.ciiva.com/854/abs07-854936.pdf?src-supplier=Digikey; ComponentLink3Description: https://datasheet.ciiva.com/854/abs07-854936.pdf?src-supplier=Digikey; ComponentLink4URL: https://datasheet.ciiva.com/854/abs07-854935.pdf?src-supplier=Digikey; ComponentLink4Description: https://datasheet.ciiva.com/854/abs07-854935.pdf?src-supplier=Digikey; ComponentLink5URL: https://datasheet.ciiva.com/854/abs07-854937.pdf?src-supplier=Digikey; ComponentLink5Description: https://datasheet.ciiva.com/854/abs07-854937.pdf?src-supplier=Digikey; ComponentLink6URL: https://datasheet.ciiva.com/4944/abs07-11028-4944830.pdf?src-supplier=Mouser; ComponentLink6Description: https://datasheet.ciiva.com/4944/abs07-11028-4944830.pdf?src-supplier=Mouser; Supplier Part Number 1: 535-9542-1-ND